# EAGLE design Dual_Power_Supply (EAGLE 9.6.2)
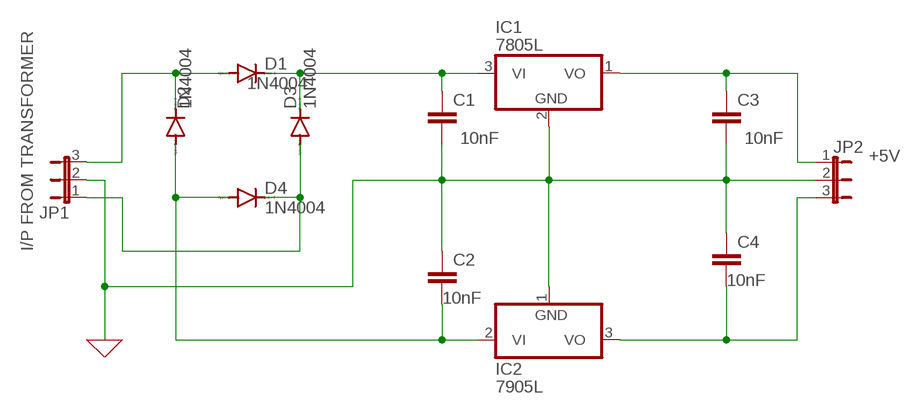
[diagram p0: schematic, sheet 1]

## Parts
C1  C2,5-3  [C2.5-3]
C2  C2,5-3  [C2.5-3]
C3  C2,5-3  [C2.5-3]
C4  C2,5-3  [C2.5-3]
D1  1N4004  [DO41-10]
D2  1N4004  [DO41-10]
D3  1N4004  [DO41-10]
D4  1N4004  [DO41-10]
IC1  7805L  [TO92]
IC3  7905L  [TO92]
JP1  JP2E  [JP2]
JP2  JP2E  [JP2]

## Nets
0: C1.2 C2.1 C3.2 C4.1 IC1.2(GND) IC3.1(GND) JP1.2 JP2.2 ; supply symbol labelled GND
N$1: D1.A D2.C JP1.3
N$2: C1.1 D1.C D3.C IC1.3(VI)
N$3: D3.A D4.C JP1.1
N$4: C2.2 D2.A D4.A IC3.2(VI)
N$5: C4.2 IC3.3(VO) JP2.3
N$6: C3.1 IC1.1(VO) JP2.1

## Notes on the sheet
- 10nF | 10nF
- +5V
- I/P FROM TRANSFORMER
- 10nF
- 10nF
- IC2
- 7905L

## Library data of the parts
C1-C4 = capacitor-wima:C: CAPACITOR naming: grid - package width
D1-D4 = diode:1N4004: DIODE general purpose rectifier, 1 A
IC1 = linear:78*: Positive VOLTAGE REGULATOR Source: http://cache.national.com/ds/LM/LM78L05.pdf http://www.fairchildsemi.com/ds/LM/LM7805.pdf
IC3 = linear:79*: Negative VOLTAGE REGULATOR
JP1 JP2 = jumper:JP2E: JUMPER

## Board
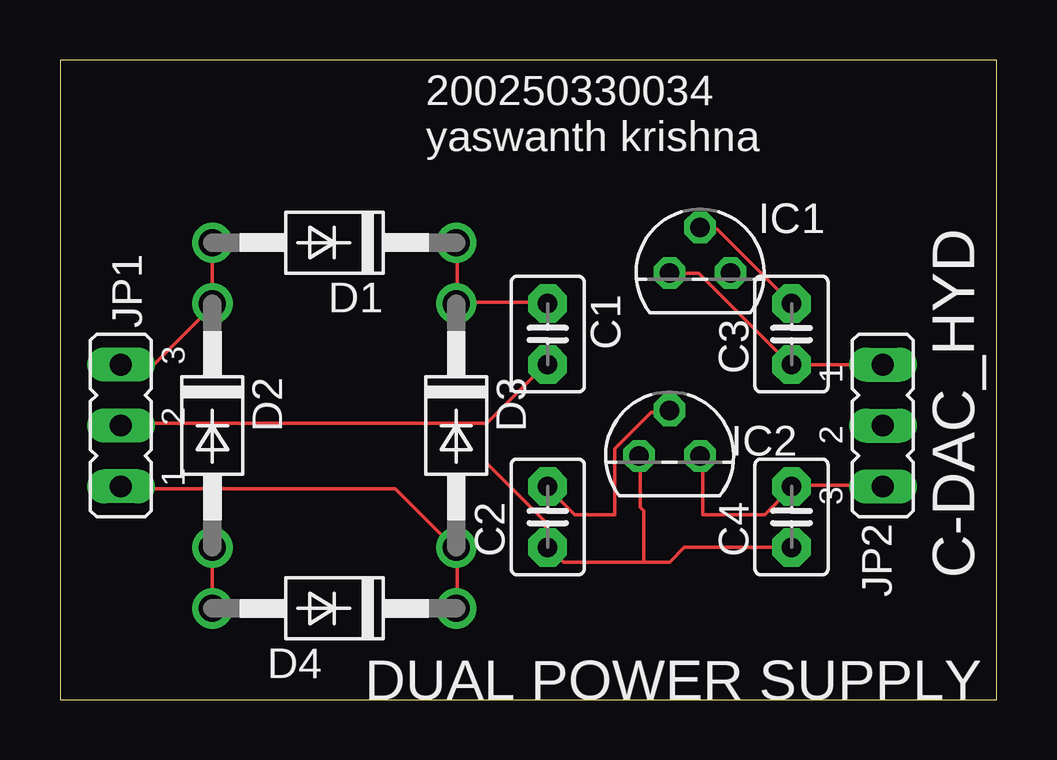
[diagram p1: board, top side]
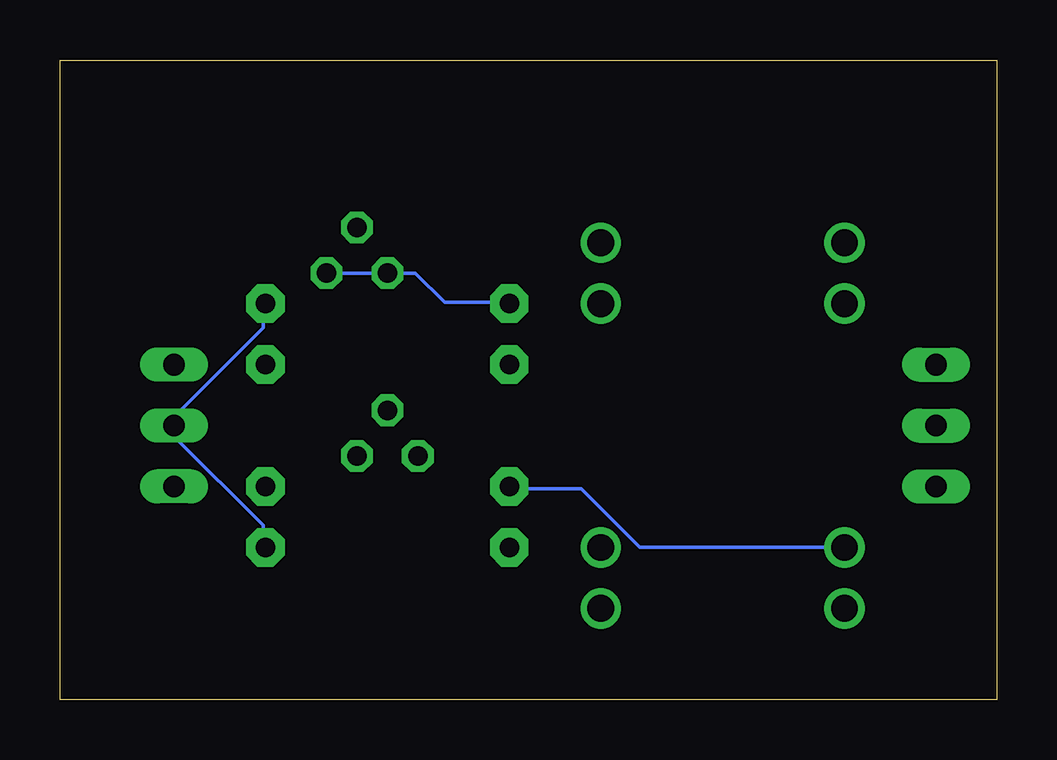
[diagram p2: board, bottom side, seen from below]

Size 39.04 x 26.66 mm. Coordinates in mm from the lower left corner, seen from the top.
Outline: 0,0 39.04,0 39.04,26.66 0,26.66 0,0
Copper layers (1*16): Top 0.035mm / dielectric 1.5mm / Bottom 0.035mm
Design rules "default": minimum track width 6mil, minimum drill 0.35mm, track to track 6mil, track to pad 6mil, pad to pad 6mil, via to via 6mil, smd to smd 6mil, copper to edge 40mil, drill to drill 6mil, minimum pad ring 10mil, minimum via ring 8mil, stop-mask expansion 4mil, vias tented up to drill 0mil, thermal gap 10mil

### Footprints (pad centres in the part's own frame; a part is rotated, then mirrored left to right if it is on the bottom)
C2.5-3 = drill 0.813 pad 1.6 octagon: 1 -1.27,0; 2 1.27,0
DO41-10 = drill 1.118: A 5.08,0; C -5.08,0
TO92 = drill 0.813 octagon: 1 -1.27,0; 2 0,1.905; 3 1.27,0
JP2 = drill 0.914 long: 1 -2.54,0; 2 0,0; 3 2.54,0

### Placement (x,y rotation side)
C1  20.32,15.24 270 top
C2  20.32,7.62 90 top
C3  30.48,15.24 90 top
C4  30.48,7.62 90 top
D1  11.43,19.05 180 top
D2  6.35,11.43 270 top
D3  16.51,11.43 270 top
D4  11.43,3.81 180 top
IC1  26.67,17.78 0 top
IC3  25.4,10.16 0 top
JP1  2.54,11.43 90 top
JP2  34.29,11.43 270 top

### Tracks (layer width: path | path; a pad name or v marks a point on that pad's centre or on a via)
0
  Top 0.152: C3.2 27.38,19.61 26.77,19.61 IC1.2 | 24.33,5.74 20.98,5.74 20.37,6.35 C2.1 20.22,6.35 20.22,7.42 17.78,9.86 17.78,11.53 | 24.33,5.74 25.4,5.74 26.01,6.35 C4.1 | 17.78,11.53 2.54,11.53 JP1.2 | 17.78,11.53 20.22,13.97 C1.2 | 24.33,5.74 24.33,7.87 24.18,8.03 24.18,10.16 IC3.1
  Bottom 0.152: C3.2 30.58,16.41 30.58,15.49 34.24,11.84 34.24,11.53 JP2.2 34.24,11.38 34.24,10.92 30.58,7.26 30.58,6.35 C4.1
N$1
  Top 0.152: JP1.3 3.91,13.97 6.35,16.41 D2.C D1.A
N$2
  Top 0.152: 16.56,16.56 16.56,19 D1.C | 16.56,16.56 20.22,16.56 C1.1 | 16.56,16.56 D3.C
  Bottom 0.152: IC1.3 24.23,17.78 23.01,16.56 20.37,16.56 C1.1
N$3
  Top 0.152: JP1.1 2.54,8.79 13.97,8.79 16.41,6.35 D3.A 16.56,6.35 16.56,3.91 D4.C
N$4
  Top 0.152: D2.A D4.A | C2.2 20.37,8.79 21.44,7.72 23.11,7.72 23.11,10.46 24.64,11.99 25.4,11.99 IC3.2
  Bottom 0.152: D2.A 14.88,6.35 17.32,8.79 20.22,8.79 C2.2
N$5
  Top 0.152: JP2.3 34.24,8.94 30.58,8.94 C4.2 30.43,8.79 29.36,7.72 26.77,7.72 26.77,10.16 IC3.3
N$6
  Top 0.152: IC1.1 26.62,17.78 30.43,13.97 C3.1 JP2.1

### Text on the board
tNames: 200250330034 / yaswanth krishna | IC2 | C-DAC_HYD | DUAL POWER SUPPLY